# Altium schematic sheet TestPoints.SchDoc: Controlador PID
size A4; Organization: Altium Limited; Address1: L3, 12a Rodborough Rd; Address2: Frenchs Forest; Address3: NSW; Address4: Australia 2086; Revision: R01; sheetnumberh: 5; sheettotall: 5; Alumno: Irumberry Iván - Matwiejczuk Leandro; Curso: 512; Materia: Técnicas Digitales III; Docentes: Ing. Marín Ariel; SheetNumber: 5; SheetTotal: 5
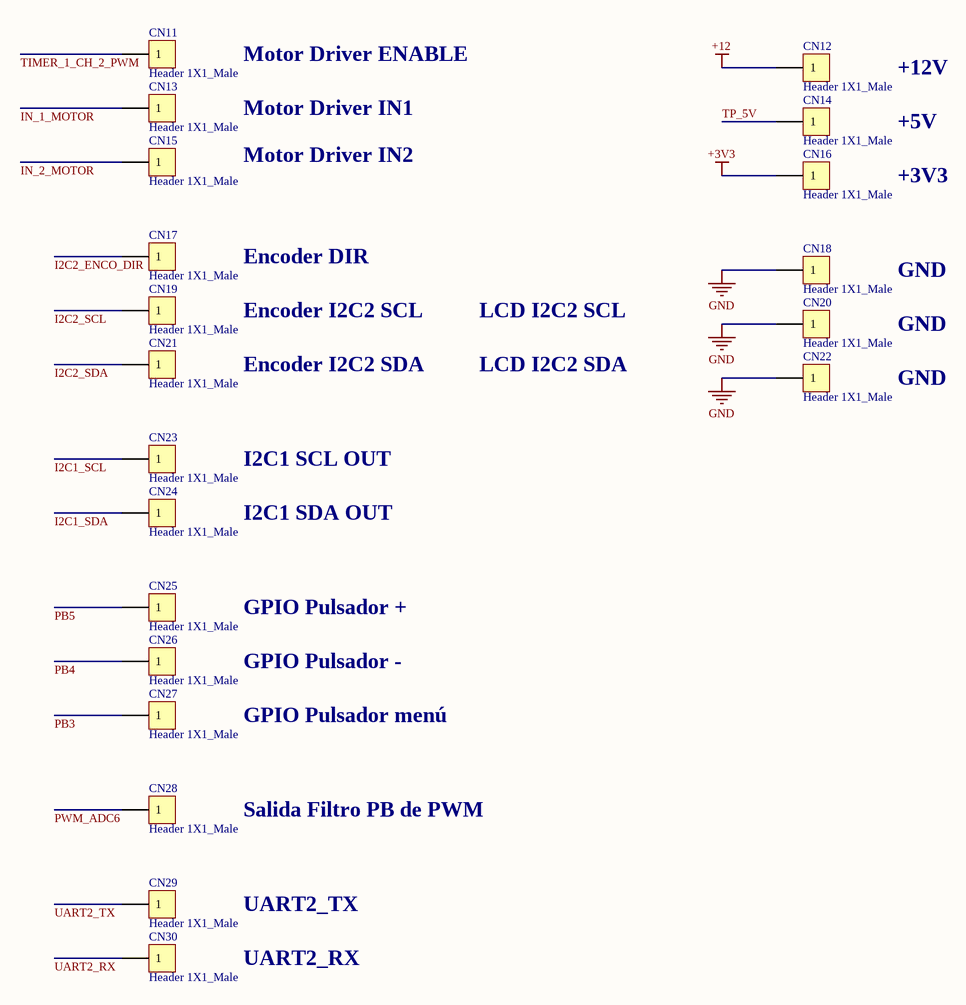
[diagram p0: TestPoints.SchDoc]

## Parts
CN11  Header 1X1_Male  [1*1P_MALE]
CN12  Header 1X1_Male  [1*1P_MALE]
CN13  Header 1X1_Male  [1*1P_MALE]
CN14  Header 1X1_Male  [1*1P_MALE]
CN15  Header 1X1_Male  [1*1P_MALE]
CN16  Header 1X1_Male  [1*1P_MALE]
CN17  Header 1X1_Male  [1*1P_MALE]
CN18  Header 1X1_Male  [1*1P_MALE]
CN19  Header 1X1_Male  [1*1P_MALE]
CN20  Header 1X1_Male  [1*1P_MALE]
CN21  Header 1X1_Male  [1*1P_MALE]
CN22  Header 1X1_Male  [1*1P_MALE]
CN23  Header 1X1_Male  [1*1P_MALE]
CN24  Header 1X1_Male  [1*1P_MALE]
CN25  Header 1X1_Male  [1*1P_MALE]
CN26  Header 1X1_Male  [1*1P_MALE]
CN27  Header 1X1_Male  [1*1P_MALE]
CN28  Header 1X1_Male  [1*1P_MALE]
CN29  Header 1X1_Male  [1*1P_MALE]
CN30  Header 1X1_Male  [1*1P_MALE]

## Nets
+3V3: CN16.1
+12: CN12.1
GND: CN18.1 CN20.1 CN22.1
I2C1_SCL: CN23.1
I2C1_SDA: CN24.1
I2C2_ENCO_DIR: CN17.1
I2C2_SCL: CN19.1
I2C2_SDA: CN21.1
IN_1_MOTOR: CN13.1
IN_2_MOTOR: CN15.1
PB3: CN27.1
PB4: CN26.1
PB5: CN25.1
PWM_ADC6: CN28.1
TIMER_1_CH_2_PWM: CN11.1
TP_5V: CN14.1
UART2_RX: CN30.1
UART2_TX: CN29.1

## Notes on the sheet
- Motor Driver ENABLE
- +12V
- Motor Driver IN1
- +5V
- Motor Driver IN2
- +3V3
- Encoder DIR
- GND
- Encoder I2C2 SCL
- LCD I2C2 SCL
- Encoder I2C2 SDA
- LCD I2C2 SDA
- I2C1 SCL OUT
- I2C1 SDA OUT
- GPIO Pulsador +
- GPIO Pulsador -
- GPIO Pulsador menú
- Salida Filtro PB de PWM
- UART2_TX
- UART2_RX
- Title:
- Revision:
- Alumnos:
- Materia:
- Docente:
- Curso:
- File:
- Date:
- Sheet
- of

## Library data of the parts
CN11-CN30 = Header 1X1_Male: Header, 1-Pin, Single row,male; LatestRevisionDate: 17-Jul-2002; LatestRevisionNote: Re-released for DXP Platform.; Publisher: Altium Limited